# Altium schematic sheet Display_PWR.SchDoc
size A4; SheetNumber: 8; SheetTotal: 8
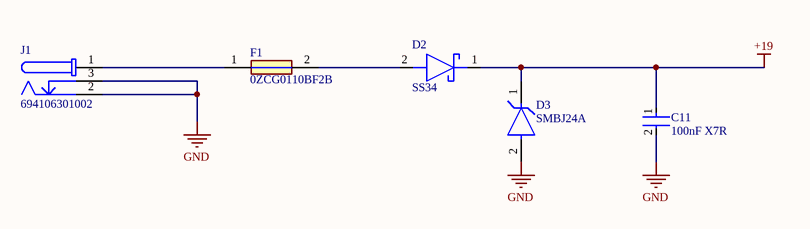
[diagram p0: Display_PWR.SchDoc]

## Parts
C11  100nF X7R  [FP-CL10-IPC_C]
D2  SS34  [DIOM8059X256N]
D3  SMBJ24A  [FP-SMBJ-MFG]
F1  0ZCG0110BF2B  [FUSC4632X130N]
J1  694106301002  [694106301002]

## Nets
+19: C11.1 D2.1(K) D3.1(C)
GND: C11.2 D3.2(A) J1.2 J1.3
NetD2_2: D2.2(A) F1.2
NetF1_1: F1.1 J1.1

## Library data of the parts
C11 = CMP-13271-001423-1: Cap Ceramic 100nF 25V X7R ±10% Pad SMD 0603 +125°C T/R; Depth: 0.8mm; Tolerance: 10%; Case Code (Imperial): 0603; Max Operating Temperature: 125°C; Min Operating Temperature: -55°C; Dielectric: X7R; Width: 0.031inch; Thickness: 0.035inch; Height: 0.8mm; Length: 1.6mm; Mount: Surface Mount; Capacitance: 100nF; Voltage Rating: 25V; Case Code (Metric): 1608; Case/Package: 0603; Radiation Hardening: No; Packaging: Tape and Reel
D2 = SS34: Schottky Diode; Manufacturer_Name: onsemi; Datasheet Link: https://www.onsemi.com/pub/Collateral/SS39-D.PDF; Height: 2.56mm; Manufacturer_Part_Number: SS34; Mouser Part Number: 512-SS34; Mouser Price/Stock: https://www.mouser.co.uk/ProductDetail/onsemi-Fairchild/SS34?qs=2ONuHmP%2FXzb3ub11UdFfdQ%3D%3D; Arrow Part Number: SS34; Arrow Price/Stock: https://www.arrow.com/en/products/ss34/on-semiconductor?utm_currency=USD&region=nac
D3 = CMP-07401-000035-1: TVS DIODE 24V 38.9V SMB; Max Breakdown Voltage: 30.7V; Operating Supply Voltage: 3.5V; Min Breakdown Voltage: 26.7V; Test Current: 1mA; Direction: Unidirectional; Peak Pulse Current: 15.4A; Peak Pulse Power: 600W; Number of Unidirectional Channels: 1; Element Configuration: Single; Power Line Protection: No; Diode Type: ZENER; Leakage Current: 5uA; Max Surge Current: 100A; ESD Protection: Yes; Width: 3.94mm; Number of Pins: 2; Clamping Voltage: 38.9V; Reverse Standoff Voltage: 24V; Breakdown Voltage: 30.7V; RoHS Compliant: Yes; Package Quantity: 1; Case/Package: SMB; Mount: Surface Mount; Resistor Type: Zener; Packaging: Tape and Reel; Reverse Breakdown Voltage: 26.7V; Series: SMBJ; Radiation Hardening: No; Max Operating Temperature: 150°C; Termination: SMD/SMT; Number of Channels: 1; Length: 4.57mm; REACH SVHC: No SVHC; Number of Elements: 1; Polarity: Unidirectional; Height: 2.42mm; Max Power Dissipation: 600W; Max Reverse Leakage Current: 5uA; Min Operating Temperature: -55°C
F1 = 0ZCG0110BF2B: Fuse; Manufacturer_Name: BelFuse; Datasheet Link: https://datasheet.datasheetarchive.com/originals/distributors/Datasheets_SAMA/44944b3a27f8483a7253631e04029a1a.pdf; Height: 1.3mm; Manufacturer_Part_Number: 0ZCG0110BF2B; Mouser Part Number: 530-0ZCG0110BF2B; Mouser Price/Stock: https://www.mouser.co.uk/ProductDetail/Bel-Fuse/0ZCG0110BF2B?qs=SRYZG9HaIQ2Phb8oqvu9NQ%3D%3D; Arrow Part Number: 0ZCG0110BF2B; Arrow Price/Stock: https://www.arrow.com/en/products/0zcg0110bf2b/bel-group
J1 = CMP-1502-00188-2: NexarPartId: 52676100; Voltage Rating (DC): 20V; Gender: Male; Voltage Rating: 24V; Connector Type: Power; Insulation Resistance: 100MΩ; Current Rating: 5A; Shielding: Unshielded; Number of Contacts: 3; Color: Black; Housing Material: Polyamide; Contact Gender: Female; REACH SVHC: Unknown; Termination: Through Hole; Height: 11mm; RoHS: Compliant; Mount: Through Hole; Flammability Rating: UL94 V-0; Packaging: Bulk; Min Operating Temperature: -40°C; Contact Plating: Tin; Max Operating Temperature: 85°C; Operating Supply Voltage: 24V; Contact Material: Gold, Tin